# Altium project EaglesPU14.PrjPcb
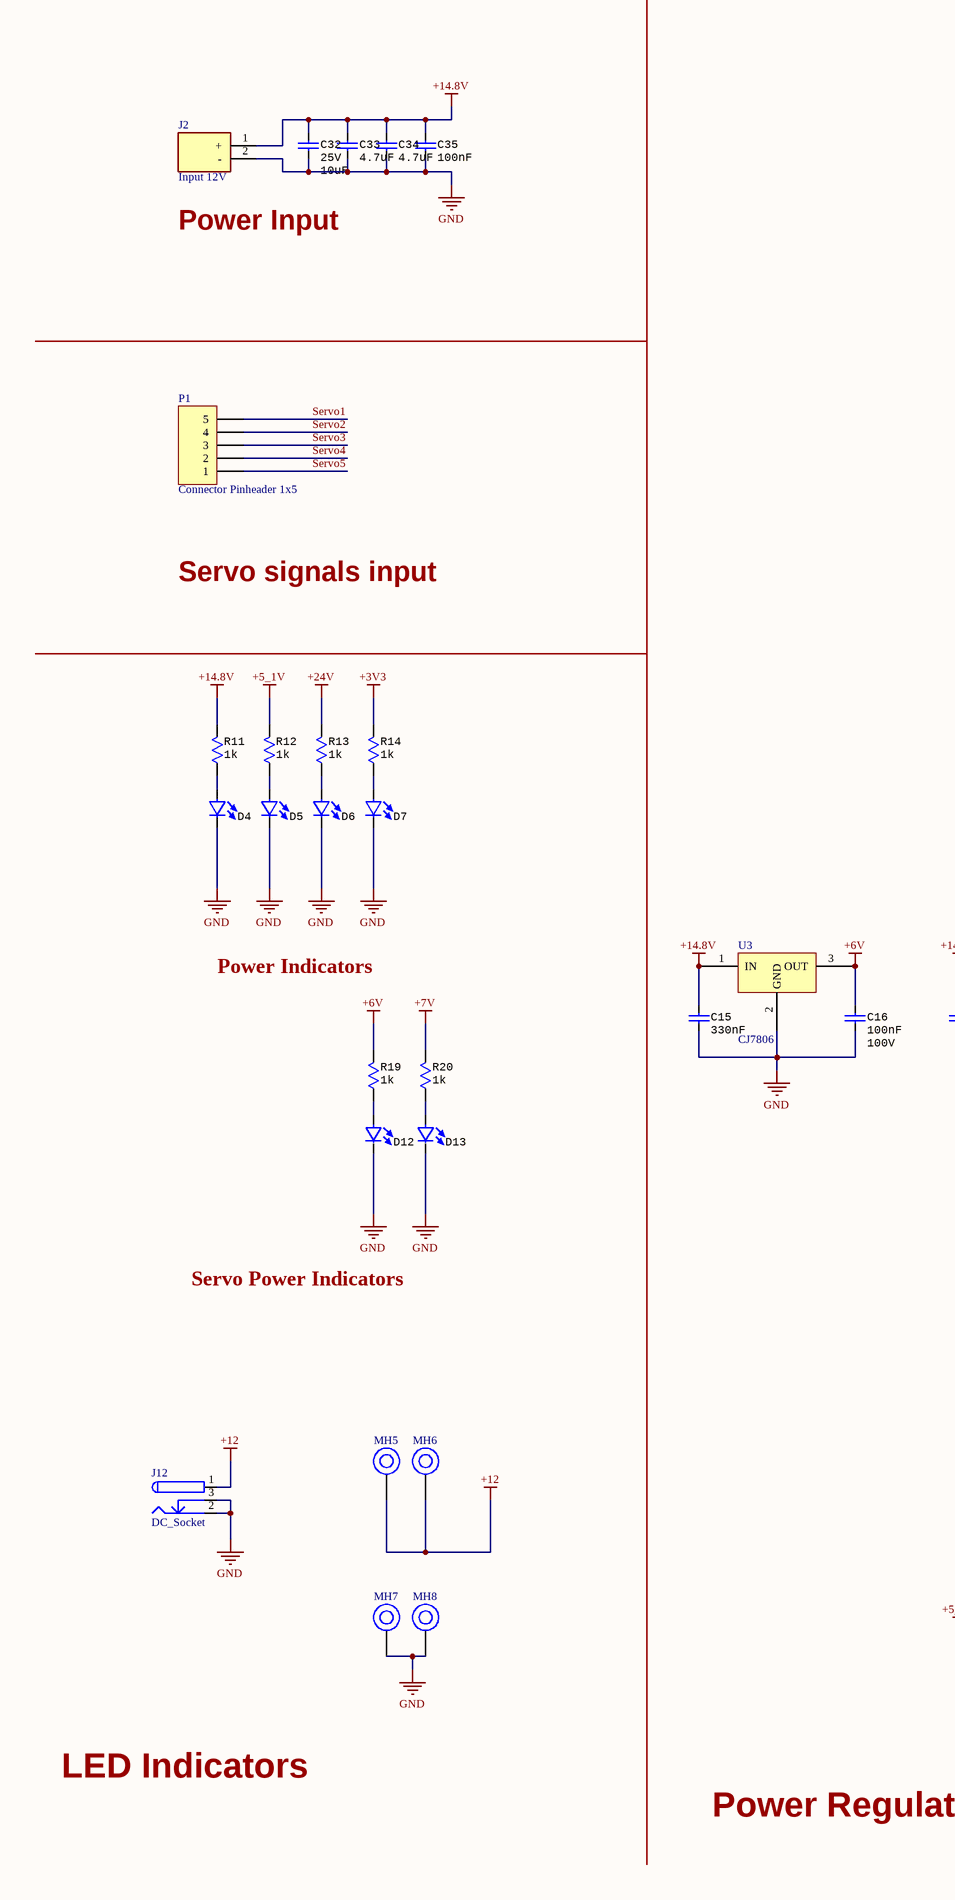
[diagram p0: EaglesPU.SchDoc, left]
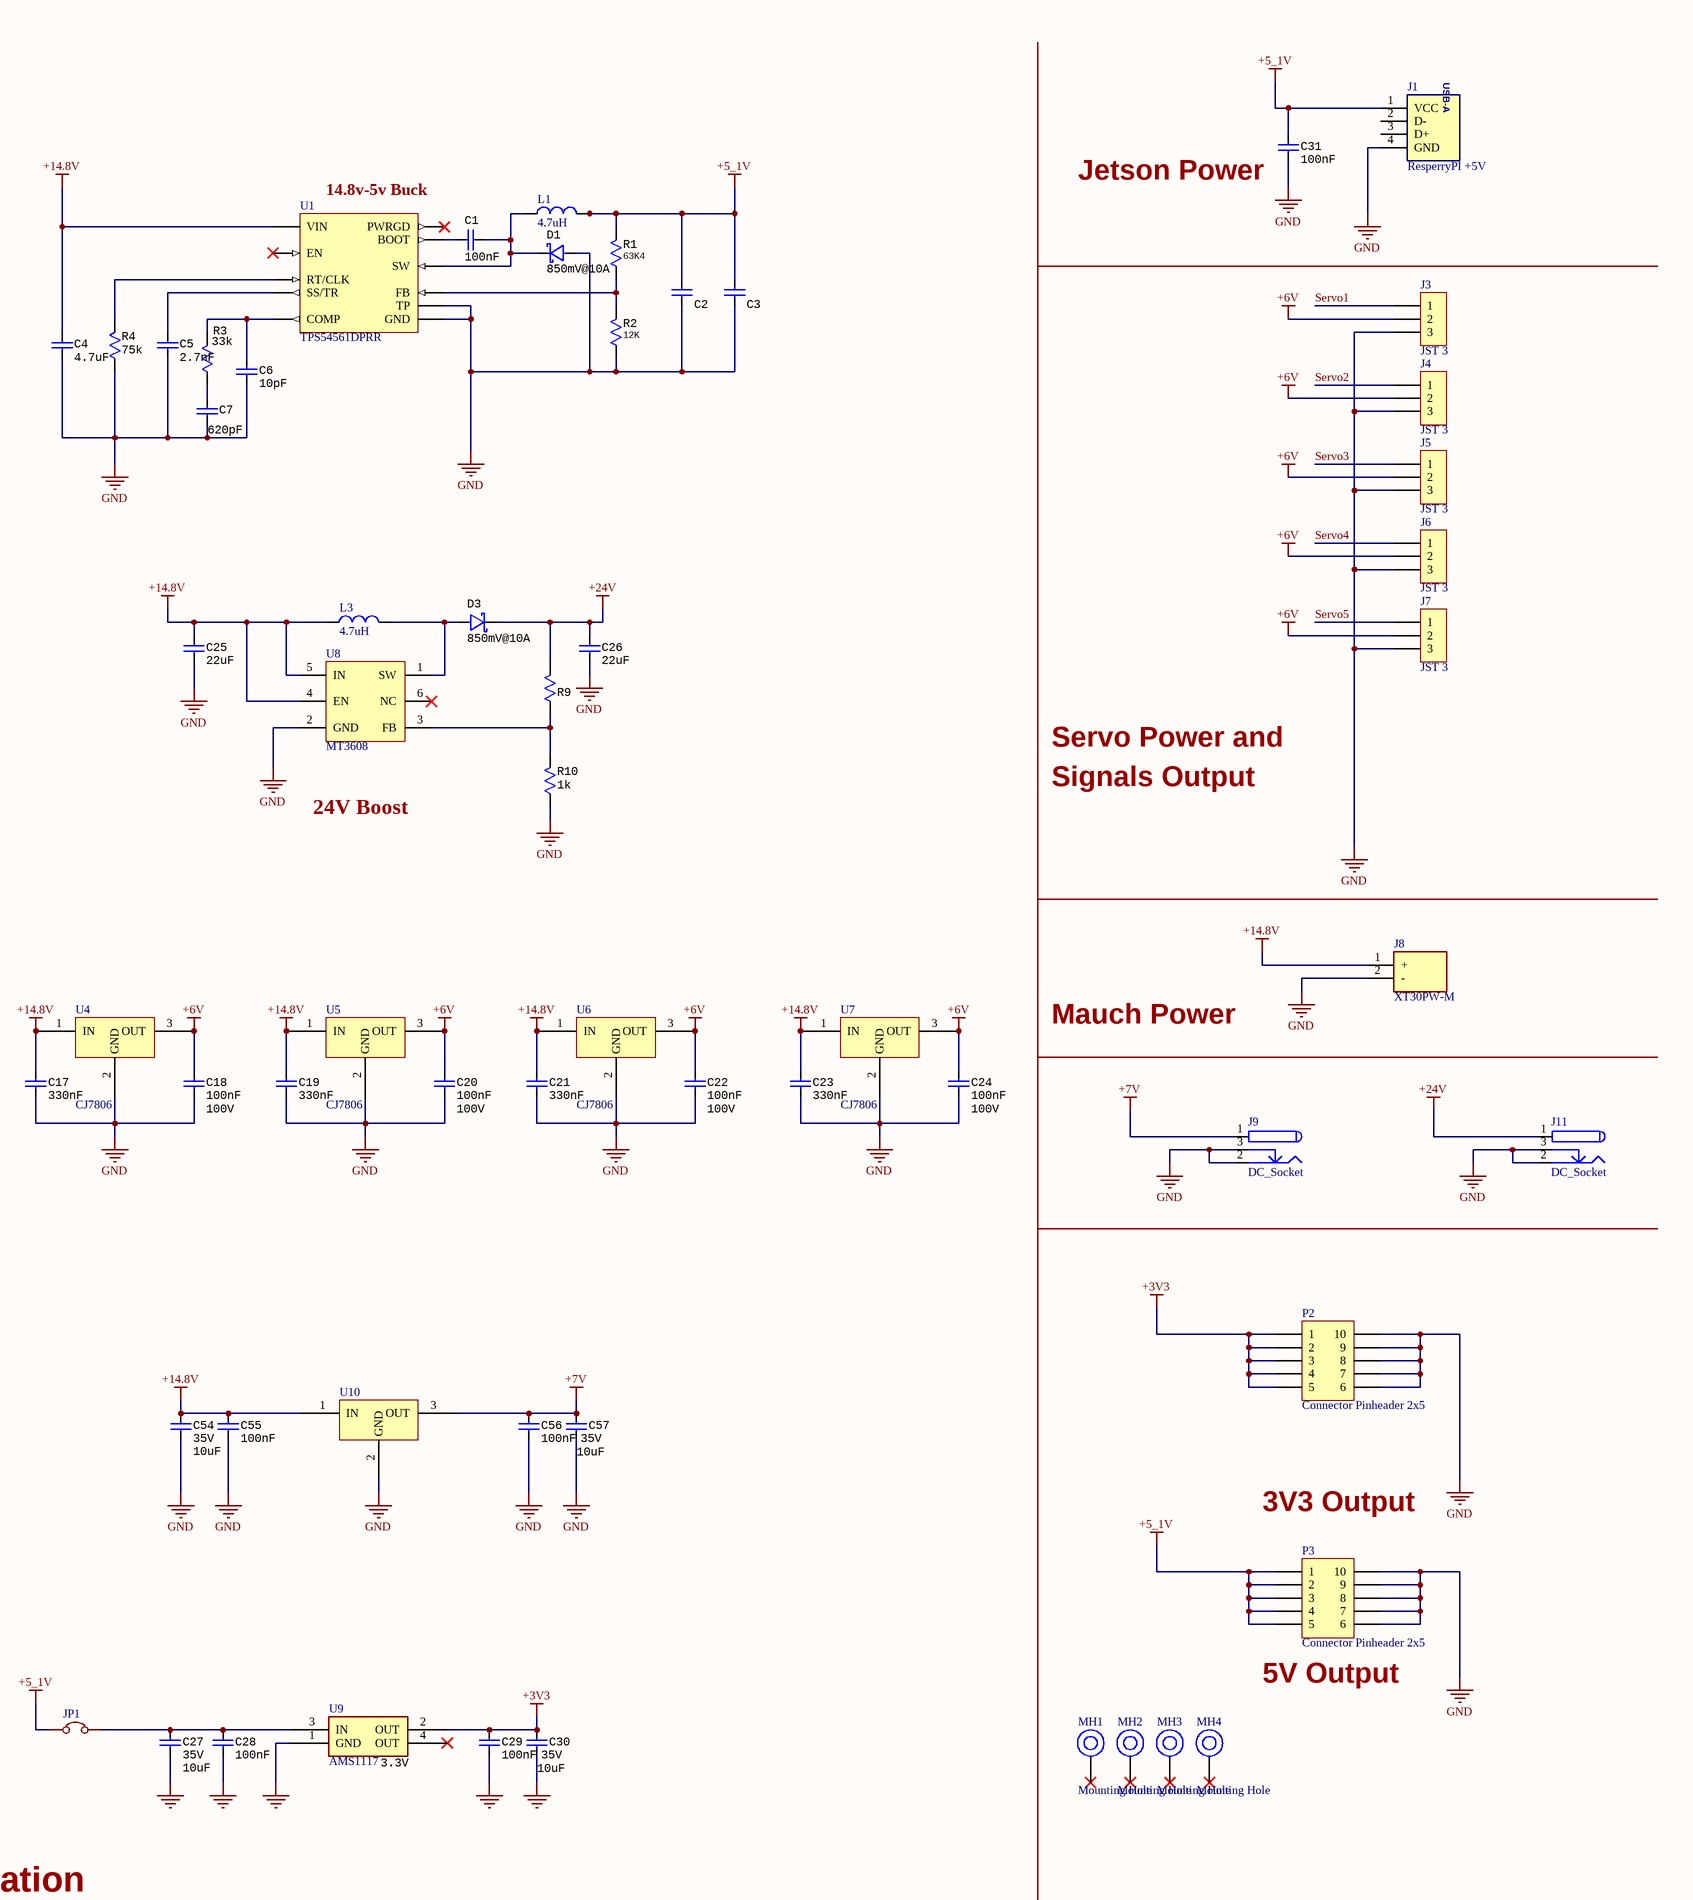
[diagram p1: EaglesPU.SchDoc, right]
1 sheet, 86 parts. Net scope: global (net labels, ports and power ports of the same name join across sheets).
Board file: PU.PcbDoc

## Sheet EaglesPU.SchDoc
size C; SheetNumber: 1; SheetTotal: 1

### Parts
C1  100nF  [CAP Ceramic SMD 0603]
C2  (no value)  [CAP Ceramic SMD 1206]
C3  (no value)  [CAP Ceramic SMD 1206]
C4  4.7uF  [CAP Ceramic SMD 1206]
C5  2.7nF  [CAP Ceramic SMD 0603]
C6  10pF  [CAP Ceramic SMD 0603]
C7  620pF  [CAP Ceramic SMD 0603]
C15  330nF  [CAP Ceramic SMD 0603]
C16  value 100nF  Voltage: 100V  [CAP Ceramic SMD 0603]
C17  330nF  [CAP Ceramic SMD 0603]
C18  value 100nF  Voltage: 100V  [CAP Ceramic SMD 0603]
C19  330nF  [CAP Ceramic SMD 0603]
C20  value 100nF  Voltage: 100V  [CAP Ceramic SMD 0603]
C21  330nF  [CAP Ceramic SMD 0603]
C22  value 100nF  Voltage: 100V  [CAP Ceramic SMD 0603]
C23  330nF  [CAP Ceramic SMD 0603]
C24  value 100nF  Voltage: 100V  [CAP Ceramic SMD 0603]
C25  22uF  [CAP Ceramic SMD 0603]
C26  22uF  [CAP Ceramic SMD 0603]
C27  Voltage: 35V  [CAP Ceramic SMD 0603]  (hidden comment: 10uF)
C28  100nF  [CAP Ceramic SMD 0603]
C29  100nF  [CAP Ceramic SMD 0603]
C30  Voltage: 35V  [CAP Ceramic SMD 0603]  (hidden comment: 10uF)
C31  100nF  [CAP Ceramic SMD 0603]
C32  value 10uF  Voltage: 25V  [CAP Ceramic SMD 1206]
C33  4.7uF  [CAP Ceramic SMD 1206]
C34  4.7uF  [CAP Ceramic SMD 1206]
C35  100nF  [CAP Ceramic SMD 0603]
C54  Voltage: 35V  [CAP Ceramic SMD 0603]  (hidden comment: 10uF)
C55  100nF  [CAP Ceramic SMD 0603]
C56  100nF  [CAP Ceramic SMD 0603]
C57  Voltage: 35V  [CAP Ceramic SMD 0603]  (hidden comment: 10uF)
D1  850mV@10A  [TO-277]
D3  850mV@10A  [TO-277]
D4  (no value)  [LED SMD 0805G]
D5  (no value)  [LED SMD 0805G]
D6  (no value)  [LED SMD 0805G]
D7  (no value)  [LED SMD 0805G]
D12  (no value)  [LED SMD 0805G]
D13  (no value)  [LED SMD 0805G]
J1  ResperryPI +5V  [USB-A/S_A]
J2  Input 12V  [XT60PW-M]
J3  JST 3  [VH3.96-3AW]
J4  JST 3  [VH3.96-3AW]
J5  JST 3  [VH3.96-3AW]
J6  JST 3  [VH3.96-3AW]
J7  JST 3  [VH3.96-3AW]
J8  XT30PW-M  [AMASS_XT30PW-F]
J9  DC_Socket  [DC-002]
J11  DC_Socket  [DC-002]
J12  DC_Socket  [DC-002]
JP1  Jumper TH 2 NC  [Jumber TH 2 NC]  (value not drawn)
L1  4.7uH  [XLS1040]
L3  4.7uH  [XLS1040]
MH1  Mounting Hole  [Connector Mounting hole TH 3mm]  (no BOM)
MH2  Mounting Hole  [Connector Mounting hole TH 3mm]  (no BOM)
MH3  Mounting Hole  [Connector Mounting hole TH 3mm]  (no BOM)
MH4  Mounting Hole  [Connector Mounting hole TH 3mm]  (no BOM)
MH5  Mounting Hole  [Connector Mounting hole TH 1mm SOLID]  (value not drawn)  (no BOM)
MH6  Mounting Hole  [Connector Mounting hole TH 1mm SOLID]  (value not drawn)  (no BOM)
MH7  Mounting Hole  [Connector Mounting hole TH 1mm SOLID]  (value not drawn)  (no BOM)
MH8  Mounting Hole  [Connector Mounting hole TH 1mm SOLID]  (value not drawn)  (no BOM)
P1  Connector Pinheader 1x5  [Header 2.54X5]
P2  Connector Pinheader 2x5  [Header 2.54_2X5]
P3  Connector Pinheader 2x5  [Header 2.54_2X5]
R1  63K4  [RES SMD 0603]
R2  12K  [RES SMD 0603]
R3  33k  [RES SMD 0603]
R4  value 75k  [RES SMD 0603]  (hidden comment: 75kR)
R9  (no value)  [RES SMD 0603]
R10  1k  [RES SMD 0603]
R11  value 1k  [RES SMD 0603]  (hidden comment: 1kR)
R12  value 1k  [RES SMD 0603]  (hidden comment: 1kR)
R13  value 1k  [RES SMD 0603]  (hidden comment: 1kR)
R14  value 1k  [RES SMD 0603]  (hidden comment: 1kR)
R19  value 1k  [RES SMD 0603]  (hidden comment: 1kR)
R20  value 1k  [RES SMD 0603]  (hidden comment: 1kR)
U1  TPS54561DPRR  [TPS54561DPRR]
U3  CJ7806  [REGULATOR TO-252(4R)-2L]
U4  CJ7806  [REGULATOR TO-252(4R)-2L]
U5  CJ7806  [REGULATOR TO-252(4R)-2L]
U6  CJ7806  [REGULATOR TO-252(4R)-2L]
U7  CJ7806  [REGULATOR TO-252(4R)-2L]
U8  MT3608  [MT3608]
U9  AMS1117  Voltage output: 3.3V  [Linear reagulator SMD AMS1117 - duplicate]
U10  BA7807FP-E2  [BA7807FP-E2]  (value not drawn)

### Nets
+3V3: C29.1 C30.1 P2.1 P2.2 P2.3 P2.4 P2.5 R14.2 U9.2(OUT)
+5_1V: C2.1 C3.1 C31.1 J1.1(VCC) JP1.1 L1.1 P3.1 P3.2 P3.3 P3.4 P3.5 R1.2 R12.2
+6V: C16.1 C18.1 C20.1 C22.1 C24.1 J3.2 J4.2 J5.2 J6.2 J7.2 R19.2 U3.3(OUT) U4.3(OUT) U5.3(OUT) U6.3(OUT) U7.3(OUT)
+7V: C56.1 C57.1 J9.1 R20.2 U10.3(OUT)
+12: J12.1 MH5.1 MH6.1
+14.8V: C4.1 C15.1 C17.1 C19.1 C21.1 C23.1 C25.1 C32.1 C33.1 C34.1 C35.1 C54.1 C55.1 J2.1(+) J8.1(+) L3.2 R11.2 U1.2(VIN) U3.1(IN) U4.1(IN) U5.1(IN) U6.1(IN) U7.1(IN) U8.4(EN) U8.5(IN) U10.1(IN)
+24V: C26.1 D3.C J11.1 R9.2 R13.2
GND: C2.2 C3.2 C4.2 C5.2 C6.2 C7.2 C15.2 C16.2 C17.2 C18.2 C19.2 C20.2 C21.2 C22.2 C23.2 C24.2 C25.2 C26.2 C27.2 C28.2 C29.2 C30.2 C31.2 C32.2 C33.2 C34.2 C35.2 C54.2 C55.2 C56.2 C57.2 D1.A D4.2 D5.2 D6.2 D7.2 D12.2 D13.2 J1.4(GND) J2.2(-) J3.3 J4.3 J5.3 J6.3 J7.3 J8.2(-) J9.2 J9.3 J11.2 J11.3 J12.2 J12.3 MH7.1 MH8.1 P2.6 P2.7 P2.8 P2.9 P2.10 P3.6 P3.7 P3.8 P3.9 P3.10 R2.1 R4.1 R10.1 U1.8(GND) U1.11(TP) U3.2(GND) U4.2(GND) U5.2(GND) U6.2(GND) U7.2(GND) U8.2(GND) U9.1(GND) U10.2(GND)
Servo1: J3.1 P1.5
Servo2: J4.1 P1.4
Servo3: J5.1 P1.3
Servo4: J6.1 P1.2
Servo5: J7.1 P1.1
NetC1_1: C1.1 U1.1(BOOT)
NetC1_2: C1.2 D1.C L1.2 U1.9(SW)
NetC5_1: C5.1 U1.4(SS/TR)
NetC6_1: C6.1 R3.2 U1.7(COMP)
NetC7_1: C7.1 R3.1
NetC27_1: C27.1 C28.1 JP1.2 U9.3(IN)
NetD3_A: D3.A L3.1 U8.1(SW)
NetD4_1: D4.1 R11.1
NetD5_1: D5.1 R12.1
NetD6_1: D6.1 R13.1
NetD7_1: D7.1 R14.1
NetD12_1: D12.1 R19.1
NetD13_1: D13.1 R20.1
NetR1_1: R1.1 R2.2 U1.6(FB)
NetR4_2: R4.2 U1.5(RT/CLK)
NetR9_1: R9.1 R10.2 U8.3(FB)

Not connected (* = marked no-connect by the designer): J1 2(D-) 3(D+); MH1 1*; MH2 1*; MH3 1*; MH4 1*; U1 3(EN)* 10(PWRGD)*; U8 6(NC)*; U9 4(OUT)*

### Notes on the sheet
- (near U1) 14.8v-5v Buck
- (near C31) Jetson Power
- Power Input
- Servo signals input
- Servo Power and
- 24V Boost
- Signals Output
- Power Indicators
- Mauch Power
- Servo Power Indicators
- 3V3 Output
- (near P3) 5V Output
- LED Indicators
- Power Regulation
- (in symbol Connector_USB-A) USB-A

### Library data of the parts
C1 C31 C35 = CAP 0603 100nF 100V: 0603 0.1 uF 100 V ±10% Tolerance X7R Multilayer Ceramic Capacitor; Manufacturer: Yageo; Manufacturer Part Number: CC0603KRX7R0BB104; Voltage Rating: 100V; RoHS: Yes; Category: Ceramic Capacitors; Stock 1: 6927977; Pricing 1: 1=0.17000, 10=0.11900, 50=0.06760, 100=0.05590, 500=0.03922, 1000=0.03246 (USD); Mount: Surface Mount; Case/Package: 0603; Case Code (Metric): 1608; Case Code (Imperial): 0603; Weight: 7.1E-05oz; Min Operating Temperature: -55°C; Max Operating Temperature: 125°C; Package Quantity: 4000; Capacitance: 100nF; Tolerance: 10%; Packaging: Tape and Reel; Dielectric: X7R; Termination: SMD/SMT; Resistor Type: Ceramic; Voltage Rating (DC): 100V; Series: CC; Length: 0.063inch; Width: 0.031inch; Thickness: 0.035inch; Depth: 0.8mm; Lead Free: Lead Free; RoHS Compliant: Yes; ComponentLink1URL: https://datasheet.ciiva.com/6277/mlccorderingcode-6277082.pdf?src-supplier=Digi-Key; ComponentLink1Description: https://datasheet.ciiva.com/6277/mlccorderingcode-6277082.pdf?src-supplier=Digi-Key; ComponentLink2URL: https://datasheet.ciiva.com/6277/mlccorderingcode-6277081.pdf?src-supplier=Digi-Key; ComponentLink2Description: https://datasheet.ciiva.com/6277/mlccorderingcode-6277081.pdf?src-supplier=Digi-Key; ComponentLink3URL: https://datasheet.ciiva.com/6277/mlccorderingcode-6277030.pdf?src-supplier=Digi-Key; ComponentLink3Description: https://datasheet.ciiva.com/6277/mlccorderingcode-6277030.pdf?src-supplier=Digi-Key; Supplier 1: LCSC; Supplier Part Number 1: C113803
C2 C3 = CAP 1206 47uF 10V X5R: 10V 22uF X7R ±10% 1206 Multilayer Ceramic Capacitors MLCC - SMD/SMT ROHS; Manufacturer: Samsung; Manufacturer Part Number: GRM31CR61A476ME15L; Value: 47uF; Temperature Characteristics Code: X5R; Supplier: LCSC; Supplier Part Number: C94034; Case/Package: 1206; Voltage Rating: 10V
C4 C33 C34 = CAP 1206 4.7uF 100V: Cap Ceramic 4.7uF 100V X7S 10% SMD 1206 125°C Emboss T/R; Manufacturer Part Number: GRM31CC72A475KE11L; Manufacturer: Murata; Category: Ceramic Capacitors; RoHS Compliant: Yes; Supplier: LCSC; Supplier Part Number: C237304; Capacitance: 4.7uF; Supplier 1: LCSC; Supplier Part Number 1: C237304; RoHS: Yes; Stock 1: 20335; Pricing 1: 5=0.31360, 50=0.26070, 150=0.23810, 500=0.15950, 2000=0.14990, 4000=0.14420 (USD); ComponentLink1URL: https://search.murata.co.jp/Ceramy/image/img/A01X/G101/ENG/GRM31CC72A475KE11-01A.pdf?src-supplier=Digi-Key; ComponentLink1Description: https://search.murata.co.jp/Ceramy/image/img/A01X/G101/ENG/GRM31CC72A475KE11-01A.pdf?src-supplier=Digi-Key
C5 = CAP 0603 2.7nF 50V: 0603 2.7 nF 50 V ±10 % Tolerance X7R SMT Multilayer Ceramic Capacitor; Manufacturer: Yageo; Manufacturer Part Number: CC0603KRX7R9BB272; Tolerance: 10%; Voltage Rating (DC): 50V; Insulation Resistance: 100GR; Supplier 1: LCSC; Supplier Part Number 1: C107085; RoHS: Yes; Category: Ceramic Capacitors; Stock 1: 143654; Pricing 1: 1=0.10000, 10=0.06100, 50=0.03320, 100=0.02710, 500=0.01934, 1000=0.01519 (USD); Mount: Surface Mount; Case/Package: 0603; Case Code (Imperial): 0603; Case Code (Metric): 1608; Dielectric Material: Ceramic; Min Operating Temperature: -55°C; Max Operating Temperature: 125°C; Capacitance: 2.7nF; Dielectric: X7R; Voltage Rating: 50V; Packaging: Tape and Reel; Termination: SMD/SMT; Resistor Type: Ceramic; Voltage: 50V; Series: CC; Construction: Flat; Length: 1.6mm; Width: 0.031inch; Height: 0.8mm; Thickness: 0.035inch; Depth: 0.8mm; Radiation Hardening: No; Lead Free: Lead Free; Halogen Free: Halogen Free; RoHS Compliant: Yes; ComponentLink1URL: https://datasheet.ciiva.com/11786/0900766b80d84f1d-11786435.pdf?src-supplier=RSComponents; ComponentLink1Description: https://datasheet.ciiva.com/11786/0900766b80d84f1d-11786435.pdf?src-supplier=RSComponents; ComponentLink2URL: https://datasheet.ciiva.com/8033/1489800-8033877.pdf?src-supplier=Element14; ComponentLink2Description: https://datasheet.ciiva.com/8033/1489800-8033877.pdf?src-supplier=Element14; ComponentLink3URL: https://datasheet.ciiva.com/13210/upy-gphc-x7r-6-3v-to-50v-8-12304-13210203.pdf?src-supplier=Mouser; ComponentLink3Description: https://datasheet.ciiva.com/13210/upy-gphc-x7r-6-3v-to-50v-8-12304-13210203.pdf?src-supplier=Mouser; ComponentLink4URL: https://datasheet.ciiva.com/11465/upy-gphc-x7r-6-3v-to-50v-8-11465237.pdf?src-supplier=Avnet; ComponentLink4Description: https://datasheet.ciiva.com/11465/upy-gphc-x7r-6-3v-to-50v-8-11465237.pdf?src-supplier=Avnet; ComponentLink5URL: https://datasheet.ciiva.com/26829/getdatasheetpartid-134617-26829446.pdf?src-supplier=Verical; ComponentLink5Description: https://datasheet.ciiva.com/26829/getdatasheetpartid-134617-26829446.pdf?src-supplier=Verical
C6 = CAP 0603 10pF 50V: Surface Mount Ceramic Multilayer Capacitor 10pF 5% C0G 50V 0603 Paper T/R; Manufacturer: Yageo; Manufacturer Part Number: CC0603JRNPO9BN100; Temperature Coefficient: 30ppm/°C; Insulation Resistance: 100GR; Capacitance: 10pF; Supplier Part Number 1: C106245; RoHS: Yes; Category: Ceramic Capacitors; Stock 1: 1278240; Pricing 1: 1=0.10000, 10=0.03600, 50=0.01960, 100=0.01590, 500=0.01138, 1000=0.00894 (USD); Mounting Technology: Surface Mount; Case/Package: 0603; Pins: 2; Case Code (Metric): 1608; Case Code (Imperial): 0603; Min Operating Temperature: -55°C; Max Operating Temperature: 125°C; Tolerance: 5%; Dielectric: C0G; Voltage: 50V; Voltage Rating: 50V; Voltage Rating (DC): 50V; Packaging: Tape and Reel; Package Quantity: 4000; Termination: SMD/SMT; Resistor Type: Ceramic; Series: CC; Length: 1.6mm; Width: 0.8mm; Height: 0.8mm; Thickness: 0.035inch; Depth: 0.8mm; Radiation Hardening: No; RoHS Compliant: Yes; Reach SVHC Compliant: Yes; Lead Free: Lead Free; ComponentLink1URL: https://datasheet.ciiva.com/144/mlccorderingcode-144651.pdf?src-supplier=Digi-Key; ComponentLink1Description: https://datasheet.ciiva.com/144/mlccorderingcode-144651.pdf?src-supplier=Digi-Key; ComponentLink2URL: https://datasheet.ciiva.com/5789/1734582-5789616.pdf?src-supplier=Farnell; ComponentLink2Description: https://datasheet.ciiva.com/5789/1734582-5789616.pdf?src-supplier=Farnell; ComponentLink3URL: https://datasheet.ciiva.com/26862/getdatasheetpartid-403524-26862758.pdf?src-supplier=Verical; ComponentLink3Description: https://datasheet.ciiva.com/26862/getdatasheetpartid-403524-26862758.pdf?src-supplier=Verical; ComponentLink4URL: https://datasheet.ciiva.com/11786/0900766b8079c870-11786407.pdf?src-supplier=Rs; ComponentLink4Description: https://datasheet.ciiva.com/11786/0900766b8079c870-11786407.pdf?src-supplier=Rs; ComponentLink5URL: https://datasheet.ciiva.com/7978/1132289-7978126.pdf?src-supplier=Element14; ComponentLink5Description: https://datasheet.ciiva.com/7978/1132289-7978126.pdf?src-supplier=Element14; ComponentLink6URL: https://datasheet.ciiva.com/46430/1835847-46430150.pdf?src-supplier=Element14; ComponentLink6Description: https://datasheet.ciiva.com/46430/1835847-46430150.pdf?src-supplier=Element14; ComponentLink7URL: https://datasheet.ciiva.com/144/mlccorderingcode-144650.pdf?src-supplier=Digi-Key; ComponentLink7Description: https://datasheet.ciiva.com/144/mlccorderingcode-144650.pdf?src-supplier=Digi-Key; ComponentLink8URL: https://datasheet.ciiva.com/144/mlccorderingcode-144649.pdf?src-supplier=Digi-Key; ComponentLink8Description: https://datasheet.ciiva.com/144/mlccorderingcode-144649.pdf?src-supplier=Digi-Key; ComponentLink9URL: https://datasheet.ciiva.com/5425/upy-gp-np0-16v-to-50v-8-5425564.pdf?src-supplier=Mouser; ComponentLink9Description: https://datasheet.ciiva.com/5425/upy-gp-np0-16v-to-50v-8-5425564.pdf?src-supplier=Mouser; ComponentLink10URL: https://datasheet.ciiva.com/8033/1734582-8033710.pdf?src-supplier=Element14; ComponentLink10Description: https://datasheet.ciiva.com/8033/1734582-8033710.pdf?src-supplier=Element14; ComponentLink11URL: https://datasheet.ciiva.com/8033/1734582-8033706.pdf?src-supplier=Element14; ComponentLink11Description: https://datasheet.ciiva.com/8033/1734582-8033706.pdf?src-supplier=Element14; Supplier 1: LCSC; Value: 10pF
C7 = CAP 0603 620pF 50V: Surface Mount Ceramic Multilayer Capacitor 620pF 5% C0G 50V 0603 Paper T/R; Manufacturer: Yageo; Manufacturer Part Number: CC0603JRNPO9BN621; Supplier 1: LCSC; Supplier Part Number 1: C325470; RoHS: Yes; Category: Ceramic Capacitors; Stock 1: 28329; Pricing 1: 1=0.26000, 10=0.17600, 50=0.10560, 100=0.08920, 500=0.06102, 1000=0.05399 (USD); Mounting Technology: Surface Mount; Case/Package: 0603; Case Code (Imperial): 0603; Case Code (Metric): 1608; Weight: 7.1E-05oz; Min Operating Temperature: -55°C; Max Operating Temperature: 125°C; Value: 620pF; Voltage Rating (DC): 50V; Tolerance: 5%; Packaging: Tape and Reel; Dielectric: C0G; Voltage Rating: 50V; Termination: SMD/SMT; Resistor Type: Ceramic; Series: CC; Length: 0.063inch; Width: 0.031inch; Thickness: 0.035inch; ComponentLink1URL: https://datasheet.ciiva.com/13265/upy-gp-np0-16v-to-50v-8-3714-13265463.pdf?src-supplier=Mouser; ComponentLink1Description: https://datasheet.ciiva.com/13265/upy-gp-np0-16v-to-50v-8-3714-13265463.pdf?src-supplier=Mouser
C15 C17 C19 C21 C23 = CAP 0603 330nF 50V: Multilayer Ceramic Capacitor, 0.33 uF, 50 V, ± 10%, X7R, 0603 [1608 Metric]; Manufacturer: TDK; Manufacturer Part Number: C1608X7R1H334K080AC; Voltage Rating: 50V; Supplier 1: LCSC; Supplier Part Number 1: C76621; RoHS: Yes; Category: Ceramic Capacitors; Stock 1: 463113; Pricing 1: 1=0.24000, 10=0.16500, 50=0.11000, 100=0.09350, 500=0.06600, 1000=0.05775 (USD); Mount: Surface Mount; Case/Package: 0603; Case Code (Metric): 1608; Case Code (Imperial): 0603; Weight: 7.1E-05oz; Dielectric Material: Ceramic; Min Operating Temperature: -55°C; Max Operating Temperature: 125°C; Capacitance: 330nF; Tolerance: 10%; Packaging: Tape and Reel; Package Quantity: 1; Voltage Rating (DC): 50V; Dielectric: X7R; Termination: SMD/SMT; Resistor Type: Ceramic; Voltage: 50V; Series: C; Construction: Flat; Length: 1.6mm; Width: 0.031inch; Height: 0.8mm; Thickness: 0.037inch; Depth: 0.8mm; Reach SVHC Compliant: Yes; Lead Free: Lead Free; RoHS Compliant: Yes; ComponentLink1URL: https://datasheet.ciiva.com/22718/1796654-22718021.pdf?src-supplier=Element14; ComponentLink1Description: https://datasheet.ciiva.com/22718/1796654-22718021.pdf?src-supplier=Element14; ComponentLink2URL: https://datasheet.ciiva.com/6290/tdkmlcccaprange-6290791.pdf?src-supplier=Digi-Key; ComponentLink2Description: https://datasheet.ciiva.com/6290/tdkmlcccaprange-6290791.pdf?src-supplier=Digi-Key; ComponentLink3URL: https://datasheet.ciiva.com/16427/general-b11-16427753.pdf?src-supplier=Future+Electronics; ComponentLink3Description: https://datasheet.ciiva.com/16427/general-b11-16427753.pdf?src-supplier=Future+Electronics; ComponentLink4URL: https://datasheet.ciiva.com/23803/1735394-23803004.pdf?src-supplier=Newark; ComponentLink4Description: https://datasheet.ciiva.com/23803/1735394-23803004.pdf?src-supplier=Newark; ComponentLink5URL: https://datasheet.ciiva.com/28451/1796654-28451356.pdf?src-supplier=Element14; ComponentLink5Description: https://datasheet.ciiva.com/28451/1796654-28451356.pdf?src-supplier=Element14; ComponentLink6URL: https://datasheet.ciiva.com/6290/tdkmlcccaprange-6290782.pdf?src-supplier=Digi-Key; ComponentLink6Description: https://datasheet.ciiva.com/6290/tdkmlcccaprange-6290782.pdf?src-supplier=Digi-Key
C16 C18 C20 C22 C24 = CAP 0603 100nF 100V X7R 10%: 100V 100nF X7R ±10% 0603 Multilayer Ceramic Capacitors MLCC - SMD/SMT ROHS; Manufacturer: Yageo; Manufacturer Part Number: CC0603KRX7R0BB104; Supplier: LCSC; Supplier Part Number: C113803; Temperature Characteristics Code: X7R
C25 C26 = CAP 0603 22uF 6.3V: 6.3V 22uF X5R ±20% 0603 Multilayer Ceramic Capacitors MLCC - SMD/SMT ROHS; Manufacturer: YAGEO; Manufacturer Part Number: CC0603MRX5R5BB226; Supplier Part Number: C109448; Supplier: LCSC; Mount: Surface Mount; Voltage: 6.3V; Capacitance: 22uF
C27 C30 C54 C57 = CAP 0603 10uF 35V: Cap Ceramic 10uF 35V X5R 20% Pad SMD 0603 85C T/R; Manufacturer: Murata; Manufacturer Part Number: GRM188R6YA106MA73D; Supplier 1: LCSC; RoHS: Yes; Category: Ceramic Capacitors; Mount: Surface Mount; Case/Package: 0603; Case Code (Metric): 1608; Case Code (Imperial): 0603; Min Operating Temperature: -55°C; Max Operating Temperature: 85°C; Packaging: Tape and Reel; Capacitance: 10uF; Voltage Rating: 35V; Tolerance: 20%; Dielectric: X5R; Voltage Rating (DC): 35V; Length: 0.063inch; Width: 0.031inch; Thickness: 0.039inch; RoHS Compliant: Yes; ComponentLink1URL: http://search.murata.co.jp/Ceramy/image/img/A01X/G101/ENG/GRM188R6YA106MA73-01.pdf?src-supplier=Future+Electronics; ComponentLink1Description: http://search.murata.co.jp/Ceramy/image/img/A01X/G101/ENG/GRM188R6YA106MA73-01.pdf?src-supplier=Future+Electronics; ComponentLink2URL: http://search.murata.co.jp/Ceramy/image/img/A01X/G101/ENG/GRM188R6YA106MA73-01.pdf?src-supplier=Digi-Key; ComponentLink2Description: http://search.murata.co.jp/Ceramy/image/img/A01X/G101/ENG/GRM188R6YA106MA73-01.pdf?src-supplier=Digi-Key; ComponentLink3URL: https://www.murata.com/~/media/webrenewal/support/library/catalog/products/capacitor/mlcc/c02e.ashx?la=en-us&src-supplier=Digi-Key; ComponentLink3Description: https://www.murata.com/~/media/webrenewal/support/library/catalog/products/capacitor/mlcc/c02e.ashx?la=en-us&src-supplier=Digi-Key; ComponentLink4URL: http://search.murata.co.jp/Ceramy/image/img/A01X/G101/ENG/GRM188R6YA106MA73-01.pdf?src-supplier=Mouser; ComponentLink4Description: http://search.murata.co.jp/Ceramy/image/img/A01X/G101/ENG/GRM188R6YA106MA73-01.pdf?src-supplier=Mouser; ComponentLink5URL: http://search.murata.co.jp/Ceramy/image/img/A01X/G101/ENG/GRM188R6YA106MA73-01.pdf?src-supplier=TTI; ComponentLink5Description: http://search.murata.co.jp/Ceramy/image/img/A01X/G101/ENG/GRM188R6YA106MA73-01.pdf?src-supplier=TTI; Supplier Part Number 1: C194427; Value: 10uF
C28 C29 C55 C56 = CAP 0603 100nF 100V: 0603 0.1 uF 100 V ±10% Tolerance X7R Multilayer Ceramic Capacitor; Manufacturer: Yageo; Manufacturer Part Number: AC0603KRX7R0BB104; Voltage Rating: 100V; Supplier: LCSC; Supplier Part Number: C408909; RoHS: Yes; Category: Ceramic Capacitors; Stock 1: 6927977; Pricing 1: 1=0.17000, 10=0.11900, 50=0.06760, 100=0.05590, 500=0.03922, 1000=0.03246 (USD); Mount: Surface Mount; Case/Package: 0603; Case Code (Metric): 1608; Case Code (Imperial): 0603; Weight: 7.1E-05oz; Min Operating Temperature: -55°C; Max Operating Temperature: 125°C; Package Quantity: 4000; Capacitance: 100nF; Tolerance: 10%; Packaging: Tape and Reel; Dielectric: X7R; Termination: SMD/SMT; Resistor Type: Ceramic; Voltage Rating (DC): 100V; Series: CC; Length: 0.063inch; Width: 0.031inch; Thickness: 0.035inch; Depth: 0.8mm; Lead Free: Lead Free; RoHS Compliant: Yes; ComponentLink1URL: https://datasheet.ciiva.com/6277/mlccorderingcode-6277082.pdf?src-supplier=Digi-Key; ComponentLink1Description: https://datasheet.ciiva.com/6277/mlccorderingcode-6277082.pdf?src-supplier=Digi-Key; ComponentLink2URL: https://datasheet.ciiva.com/6277/mlccorderingcode-6277081.pdf?src-supplier=Digi-Key; ComponentLink2Description: https://datasheet.ciiva.com/6277/mlccorderingcode-6277081.pdf?src-supplier=Digi-Key; ComponentLink3URL: https://datasheet.ciiva.com/6277/mlccorderingcode-6277030.pdf?src-supplier=Digi-Key; ComponentLink3Description: https://datasheet.ciiva.com/6277/mlccorderingcode-6277030.pdf?src-supplier=Digi-Key
C32 = CAP 1206 10uF 25V X7R 10%: 25V 10uF X7R ±10% 1206 Multilayer Ceramic Capacitors MLCC - SMD/SMT ROHS; Manufacturer: Samsung Electro-Mechanics; Manufacturer Part Number: CL31B106KAHNNNE; Supplier: LCSC; Supplier Part Number: C14860
D1 D3 = Schottky 100V 750mV@10A: 100V 750mV@10A 10A TO-277 Schottky Barrier Diodes (SBD) ROHS; Manufacturer: MDD（Microdiode Electronics）; Manufacturer Part number: SB10100L; Vf@If: 850mV@10A; Supplier: LCSC; Supplier Part Number: C113946
D4-D7 D12 D13 = LED 0805 Emerald: emerald 0805 Light Emitting Diodes (LED) ROHS; Manufacturer: FOSHAN Nationstar Optoelectronics; Manufacturer Part Number: NCD0805G1; Supplier: LCSC; Supplier Part Number: C84260; RoHS: No; Category: Uncategorized; Stock 1: 432460; Pricing 1: 20=0.01910, 200=0.01510, 600=0.01290, 3000=0.01160, 9000=0.01050, 21000=0.00990 (USD)
J1 = Connector_USB-A
J2 = XT60PW-M: Power Connectors ROHS; Manufacturer: Changzhou Amass Elec; ManufacturerPartNumber: XT60PW-M; Supplier: LCSC; SupplierPartNumber: C98732
J3-J7 = JST 3: MaleHeader 3x1
J8 = XT30PW-M: Power Connectors ROHS; Manufacturer: Changzhou Amass Elec; Manufacturer Part Number: XT30PW-M; Supplier: LCSC; Supplier Part Number: C2913282
J9 J11 J12 = DC_Socket: CIRCULAR DC POWER CONNECTOR / Rated Current: 7.5A / Rated Volatage: 20VDC
JP1 = Jumper TH 2 NC: Normally closed jumper; Manufacturer: XFCN; Manufacturer Part Number: PZ254V-11-02P; Supplier: LCSC; Supplier Part Number: C492401
L1 L3 = IND 0403 4.7uH 20%: 9A 4.7uH ±20% 17mΩ 15A SMD,11.5x10x3.8mm Power Inductors ROHS; Manufacturer: Cjiang; Manufacturer Part Number: FXL1040-4R7-M; Suppleir Part Number: C167230; Supplier: LCSC; ComponentLink1Description: LCSC; ComponentLink1URL: https://www.lcsc.com/product-detail/Power-Inductors_cjiang-Changjiang-Microelectronics-Tech-FXL1040-4R7-M_C167230.html
P1 = Connector Pinheader 1x5: Header_5x1
P2 P3 = Connector Pinheader 2x5: Header_2X5
R1 = RES 0603 63K4 1%: 100mW Thick Film Resistors 75V ±100ppm/℃ ±1% -55℃~+155℃ 63.4kΩ 0603 Chip Resistor - Surface Mount ROHS; Manufacturer: Yageo; Manufacturer Part Number: AC0603FR-0763K4L; Resistance: 63.4kR; Temperature Coefficient: 100ppm/°C; Voltage Rating: 50V; Category: Chip SMD Resistors; Case Code (Imperial): 0603; Case Code (Metric): 1608; Case/Package: 0603; Construction: Rectangular; Depth: 0.8mm; Features: Moisture Resistant,Automotive AEC-Q200; Height: 0.022inch; Lead Free: Lead Free; Length: 0.063inch; Max Operating Temperature: 155°C; Max Power Dissipation: 100mW; Military Standard: Not; Min Operating Temperature: -55°C; Number of Pins: 2; Number of Terminations: 2; Package Quantity: 1; Packaging: Tape and Reel; Power Rating: 100mW; Reach SVHC Compliant: Yes; Resistance Tolerance: 1%; Resistor Type: Thick Film; RoHS Compliant: Yes; Series: RC; Size Code: 0603; Termination: SMD/SMT; Tolerance: 1%; Voltage Rating (DC): 50V; Width: 0.031inch; Supplier: LCSC; Supplier Part Number: C228003
R2 = RES 0603 12K 1%: 100mW Thick Film Resistors 75V ±100ppm/℃ ±1% -55℃~+155℃ 12kΩ 0603 Chip Resistor - Surface Mount ROHS; Manufacturer: Yageo; Manufacturer Part Number: RC0603FR-0712KL; Resistance: 12kR; Temperature Coefficient: 100ppm/°C; Voltage Rating: 50V; Category: Chip SMD Resistors; Case Code (Imperial): 0603; Case Code (Metric): 1608; Case/Package: 0603; Construction: Rectangular; Depth: 0.8mm; Features: Moisture Resistant; Height: 0.022inch; Lead Free: Lead Free; Length: 1.6mm; Max Operating Temperature: 155°C; Max Power Dissipation: 100mW; Military Standard: Not; Min Operating Temperature: -55°C; Number of Pins: 2; Number of Terminations: 2; Package Quantity: 1; Packaging: Tape and Reel; Power Rating: 100mW; Reach SVHC Compliant: Yes; Resistance Tolerance: 1%; Resistor Type: Thick Film; RoHS Compliant: Yes; Series: RC; Size Code: 0603; Termination: SMD/SMT; Tolerance: 1%; Voltage Rating (DC): 50V; Width: 0.8mm; Supplier: LCSC; Supplier Part Number: C114659
R3 R9 = RES 0603 39k 1%: 100mW Thick Film Resistors 75V ±100ppm/℃ ±1% -55℃~+155℃ 39kΩ 0603 Chip Resistor - Surface Mount ROHS; Manufacturer: Uniroyal; Manufacturer Part Number: 0603WAF3902T5E; Supplier 1: LCSC; Supplier Part Number 1: C23153; RoHS: Yes; Stock 1: 490200; Pricing 1: 100=0.00100, 1000=0.00070, 5000=0.00060, 50000=0.00050 (USD); RoHS Compliant: Yes
  R3: Resistance: 33k
R4 = RES 0603 75k 1%: Res Thick Film 0603 75K Ohm 1% 0.1W(1/10W) ±100ppm/C Pad SMD Automotive T/R; Manufacturer: Panasonic; Manufacturer Part Number: ERJ3RBD7502V; Tolerance: 0.5%; Temperature Coefficient: 50ppm/°C; Power Rating: 100mW; Voltage Rating: 50V; Supplier 1: LCSC; RoHS: Yes; Category: Chip SMD Resistors; Stock 1: 1820; Pricing 1: 20=0.002200, 200=0.001800, 600=0.001600, 2000=0.001400, 10000=0.001300, 20000=0.001300 (AUD); Mount: Surface Mount; Case/Package: 0603; Case Code (Metric): 1608; Case Code (Imperial): 0603; Min Operating Temperature: -55°C; Max Operating Temperature: 125°C; Packaging: Cut Tape; Resistance: 75kR; Resistor Type: Thick Film; Termination: Solder; Voltage Rating (DC): 50V; Length: 1.6mm; Height: 0.45mm; Depth: 0.8mm; RoHS Compliant: Yes; REACH SVHC: No SVHC; Military Standard: Not; ComponentLink1URL: http://www.farnell.com/datasheets/1911175.pdf?src-supplier=Farnell; ComponentLink1Description: http://www.farnell.com/datasheets/1911175.pdf?src-supplier=Farnell; ComponentLink2URL: https://industrial.panasonic.com/cdbs/www-data/pdf/RDM0000/DMM0000COL11.pdf?src-supplier=Digi-Key; ComponentLink2Description: https://industrial.panasonic.com/cdbs/www-data/pdf/RDM0000/DMM0000COL11.pdf?src-supplier=Digi-Key; ComponentLink3URL: http://www.farnell.com/datasheets/1911175.pdf?src-supplier=Element14; ComponentLink3Description: http://www.farnell.com/datasheets/1911175.pdf?src-supplier=Element14; ComponentLink4URL: http://www.farnell.com/datasheets/1678782.pdf?src-supplier=Element14; ComponentLink4Description: http://www.farnell.com/datasheets/1678782.pdf?src-supplier=Element14; Supplier Part Number 1: C336823; Supplier 2: LCSC; Stock 2: 800; Pricing 2: 50=0.009200, 500=0.007300, 1500=0.006200, 5000=0.005500, 25000=0.005000, 50000=0.004700 (AUD); Contact Plating: Tin; Number of Terminations: 2; Max Power Dissipation: 100mW; Series: ERJ; Package Quantity: 1; Features: Automotive AEC-Q200; Construction: Rectangular; Resistance Tolerance: 1%; Technology: THICK FILM; Width: 0.031inch; Radiation Hardening: No; Lead Free: Lead Free; ComponentLink5URL: https://datasheet.ciiva.com/34303/1988401-34303605.pdf?src-supplier=Jameco; ComponentLink5Description: https://datasheet.ciiva.com/34303/1988401-34303605.pdf?src-supplier=Jameco; ComponentLink6URL: https://datasheet.ciiva.com/46374/426256-46374235.pdf?src-supplier=Element14; ComponentLink6Description: https://datasheet.ciiva.com/46374/426256-46374235.pdf?src-supplier=Element14; ComponentLink7URL: https://datasheet.ciiva.com/28596/1678782-28596232.pdf?src-supplier=Element14; ComponentLink7Description: https://datasheet.ciiva.com/28596/1678782-28596232.pdf?src-supplier=Element14; ComponentLink8URL: https://datasheet.ciiva.com/28676/1678782-28676971.pdf?src-supplier=Element14; ComponentLink8Description: https://datasheet.ciiva.com/28676/1678782-28676971.pdf?src-supplier=Element14; ComponentLink9URL: https://datasheet.ciiva.com/24069/aoa0000ce2-24069064.pdf?src-supplier=Mouser; ComponentLink9Description: https://datasheet.ciiva.com/24069/aoa0000ce2-24069064.pdf?src-supplier=Mouser; ComponentLink10URL: https://datasheet.ciiva.com/9187/aoa0000ce2-9187719.pdf?src-supplier=Avnet; ComponentLink10Description: https://datasheet.ciiva.com/9187/aoa0000ce2-9187719.pdf?src-supplier=Avnet; ComponentLink11URL: https://datasheet.ciiva.com/48531/aoa0000ce2-48531550.pdf?src-supplier=Avnet; ComponentLink11Description: https://datasheet.ciiva.com/48531/aoa0000ce2-48531550.pdf?src-supplier=Avnet; ComponentLink12URL: https://datasheet.ciiva.com/31835/aoa0000ce2-31835674.pdf?src-supplier=Onlinecomponents.com; ComponentLink12Description: https://datasheet.ciiva.com/31835/aoa0000ce2-31835674.pdf?src-supplier=Onlinecomponents.com; ComponentLink13URL: https://datasheet.ciiva.com/15159/getdatasheetpartid-28812-15159210.pdf?src-supplier=Verical; ComponentLink13Description: https://datasheet.ciiva.com/15159/getdatasheetpartid-28812-15159210.pdf?src-supplier=Verical; Supplier Part Number 2: C403347
R10 = RES 0603 1k 1%: Res Thick Film 0603 1K Ohm 1% 1/10W ±100ppm/°C Molded SMD Punched Carrier T/R; Manufacturer: Panasonic; Manufacturer Part Number: ERJ3EKF1001V; Supplier: LCSC; Supplier Part Number: C118155; Value: 1k
R11-R14 R19 R20 = RES 0603 1k 1%: Res Thick Film 0603 1K Ohm 1% 1/10W ±100ppm/°C Molded SMD Punched Carrier T/R; Manufacturer: Panasonic; Manufacturer Part Number: ERJ3EKF1001V; Power Rating: 100mW; Voltage Rating: 75V; Supplier 1: LCSC; RoHS: Yes; Category: Chip SMD Resistors; Stock 1: 79650; Pricing 1: 50=0.009600, 500=0.008100, 1500=0.007300, 5000=0.006800, 25000=0.006400, 50000=0.006200 (AUD); Mount: Surface Mount; Case/Package: 0603; Number of Pins: 2; Case Code (Metric): 1608; Case Code (Imperial): 0603; Contact Plating: Tin; Size Code: 0603; Min Operating Temperature: -55°C; Max Operating Temperature: 155°C; Packaging: Tape and Reel; Resistance: 1kR; Resistor Type: Thick Film; Temperature Coefficient: 100ppm/°C; Series: ERJ; Tolerance: 1%; Number of Terminations: 2; Max Power Dissipation: 100mW; Construction: Rectangular; Features: Automotive AEC-Q200; Package Quantity: 5000; Termination: SMD/SMT; Voltage Rating (DC): 75V; Resistance Tolerance: 1%; Technology: THICK FILM; Length: 1.6mm; Width: 0.8mm; Height: 0.45mm; Depth: 0.8mm; Radiation Hardening: No; RoHS Compliant: Yes; Lead Free: Lead Free; Military Standard: Not; REACH SVHC: No SVHC; ComponentLink1URL: https://datasheet.ciiva.com/7942/aoa0000ce2-7942427.pdf?src-supplier=Element14; ComponentLink1Description: https://datasheet.ciiva.com/7942/aoa0000ce2-7942427.pdf?src-supplier=Element14; ComponentLink2URL: https://datasheet.ciiva.com/46373/1678782-46373340.pdf?src-supplier=Element14; ComponentLink2Description: https://datasheet.ciiva.com/46373/1678782-46373340.pdf?src-supplier=Element14; ComponentLink3URL: https://datasheet.ciiva.com/22673/1678782-22673918.pdf?src-supplier=Element14; ComponentLink3Description: https://datasheet.ciiva.com/22673/1678782-22673918.pdf?src-supplier=Element14; ComponentLink4URL: https://datasheet.ciiva.com/46373/1678782-46373339.pdf?src-supplier=Element14; ComponentLink4Description: https://datasheet.ciiva.com/46373/1678782-46373339.pdf?src-supplier=Element14; ComponentLink5URL: https://datasheet.ciiva.com/24070/aoa0000ce2-24070269.pdf?src-supplier=Mouser; ComponentLink5Description: https://datasheet.ciiva.com/24070/aoa0000ce2-24070269.pdf?src-supplier=Mouser; ComponentLink6URL: https://datasheet.ciiva.com/16768/70260748-16768437.pdf?src-supplier=Allied+Electronics; ComponentLink6Description: https://datasheet.ciiva.com/16768/70260748-16768437.pdf?src-supplier=Allied+Electronics; ComponentLink7URL: https://datasheet.ciiva.com/16774/70260748-16774550.pdf?src-supplier=Allied+Electronics; ComponentLink7Description: https://datasheet.ciiva.com/16774/70260748-16774550.pdf?src-supplier=Allied+Electronics; ComponentLink8URL: https://datasheet.ciiva.com/9198/aoa0000ce2-9198923.pdf?src-supplier=Avnet; ComponentLink8Description: https://datasheet.ciiva.com/9198/aoa0000ce2-9198923.pdf?src-supplier=Avnet; ComponentLink9URL: https://datasheet.ciiva.com/16449/aoa0000ce2-16449065.pdf?src-supplier=Future+Electronics; ComponentLink9Description: https://datasheet.ciiva.com/16449/aoa0000ce2-16449065.pdf?src-supplier=Future+Electronics; ComponentLink10URL: https://datasheet.ciiva.com/48530/aoa0000ce2-48530987.pdf?src-supplier=Avnet; ComponentLink10Description: https://datasheet.ciiva.com/48530/aoa0000ce2-48530987.pdf?src-supplier=Avnet; ComponentLink11URL: https://datasheet.ciiva.com/30063/aoa0000ce2-30063390.pdf?src-supplier=Onlinecomponents.com; ComponentLink11Description: https://datasheet.ciiva.com/30063/aoa0000ce2-30063390.pdf?src-supplier=Onlinecomponents.com; Supplier Part Number 1: C118155
U1 = TPS54561DPRR: 4.5V to 60V Input 5A Step-Down DC-DC Converter With Soft-Start and Eco-mode 10-WSON -40 to 125; Manufacturer: Texas Instruments; Max Output Voltage: 59V; Min Output Voltage: 800mV; Number of Outputs: 1; Output Configuration: Positive; Output Type: Adjustable; Quiescent Current: 152uA; Switching Frequency: 2.5MHz; Synchronous Rectifier: No; Category: Voltage Regulators - Switching; Lead Free: Lead Free; Manufacturer Part Number: TPS54561DPRR; Max Input Voltage: 60V; Max Operating Temperature: 125°C; Max Output Current: 5A; Min Input Voltage: 4.5V; Min Operating Temperature: -40°C; Mount: Surface Mount; Number of Pins: 10; Operating Supply Voltage: 60V; Output Current: 5A; Output Voltage: 59V; Package Quantity: 3000; Packaging: Tape and Reel; Radiation Hardening: No; RoHS Compliant: Yes
U3-U7 = CJ7806: 75dB@(120Hz) 1.5A Fixed 6V Positive electrode 35V TO-252-2(DPAK) Linear Voltage Regulators (LDO) ROHS; Manufacturer: JIANGSU CHANGJIANG ELECTRONICS TECHNOLOGY CO., LTD; Supplier: LCSC; Manufacturer Part Number: CJ7806; Supplier Part Number: C188194; Max input voltage: 35V
U8 = MT3608: boost converterType 28V 2V~24V SOT-23-6 DC-DC Converters ROHS; Manufacturer: XI'AN Aerosemi Tech; Supplier: LCSC; Manufacturer Part Number: MT3608; Supplier Part Number: C84817
U9 = AMS1117: Manufacturer: Advanced Monolithic Systems; Voltage max: 15V; Current max: 10mA; Operating temperature: 0°C ~ 125°C; HelpURL: https://forum.digikey.com/t/cross-reference-for-ams1117-3-3/4397
U10 = BA7807FP-E2: 1A 69dB@(120Hz) Fixed 7V Positive electrode 22V TO-252-3 Linear Voltage Regulators (LDO) ROHS; Manufacturer: ROHM Semicon; Supplier: LCSC; Manufacturer Part Number: BA7807FP-E2; Supplier Part Number: C79648